# EAGLE schematic jncc3000 (EAGLE 6.5.0)
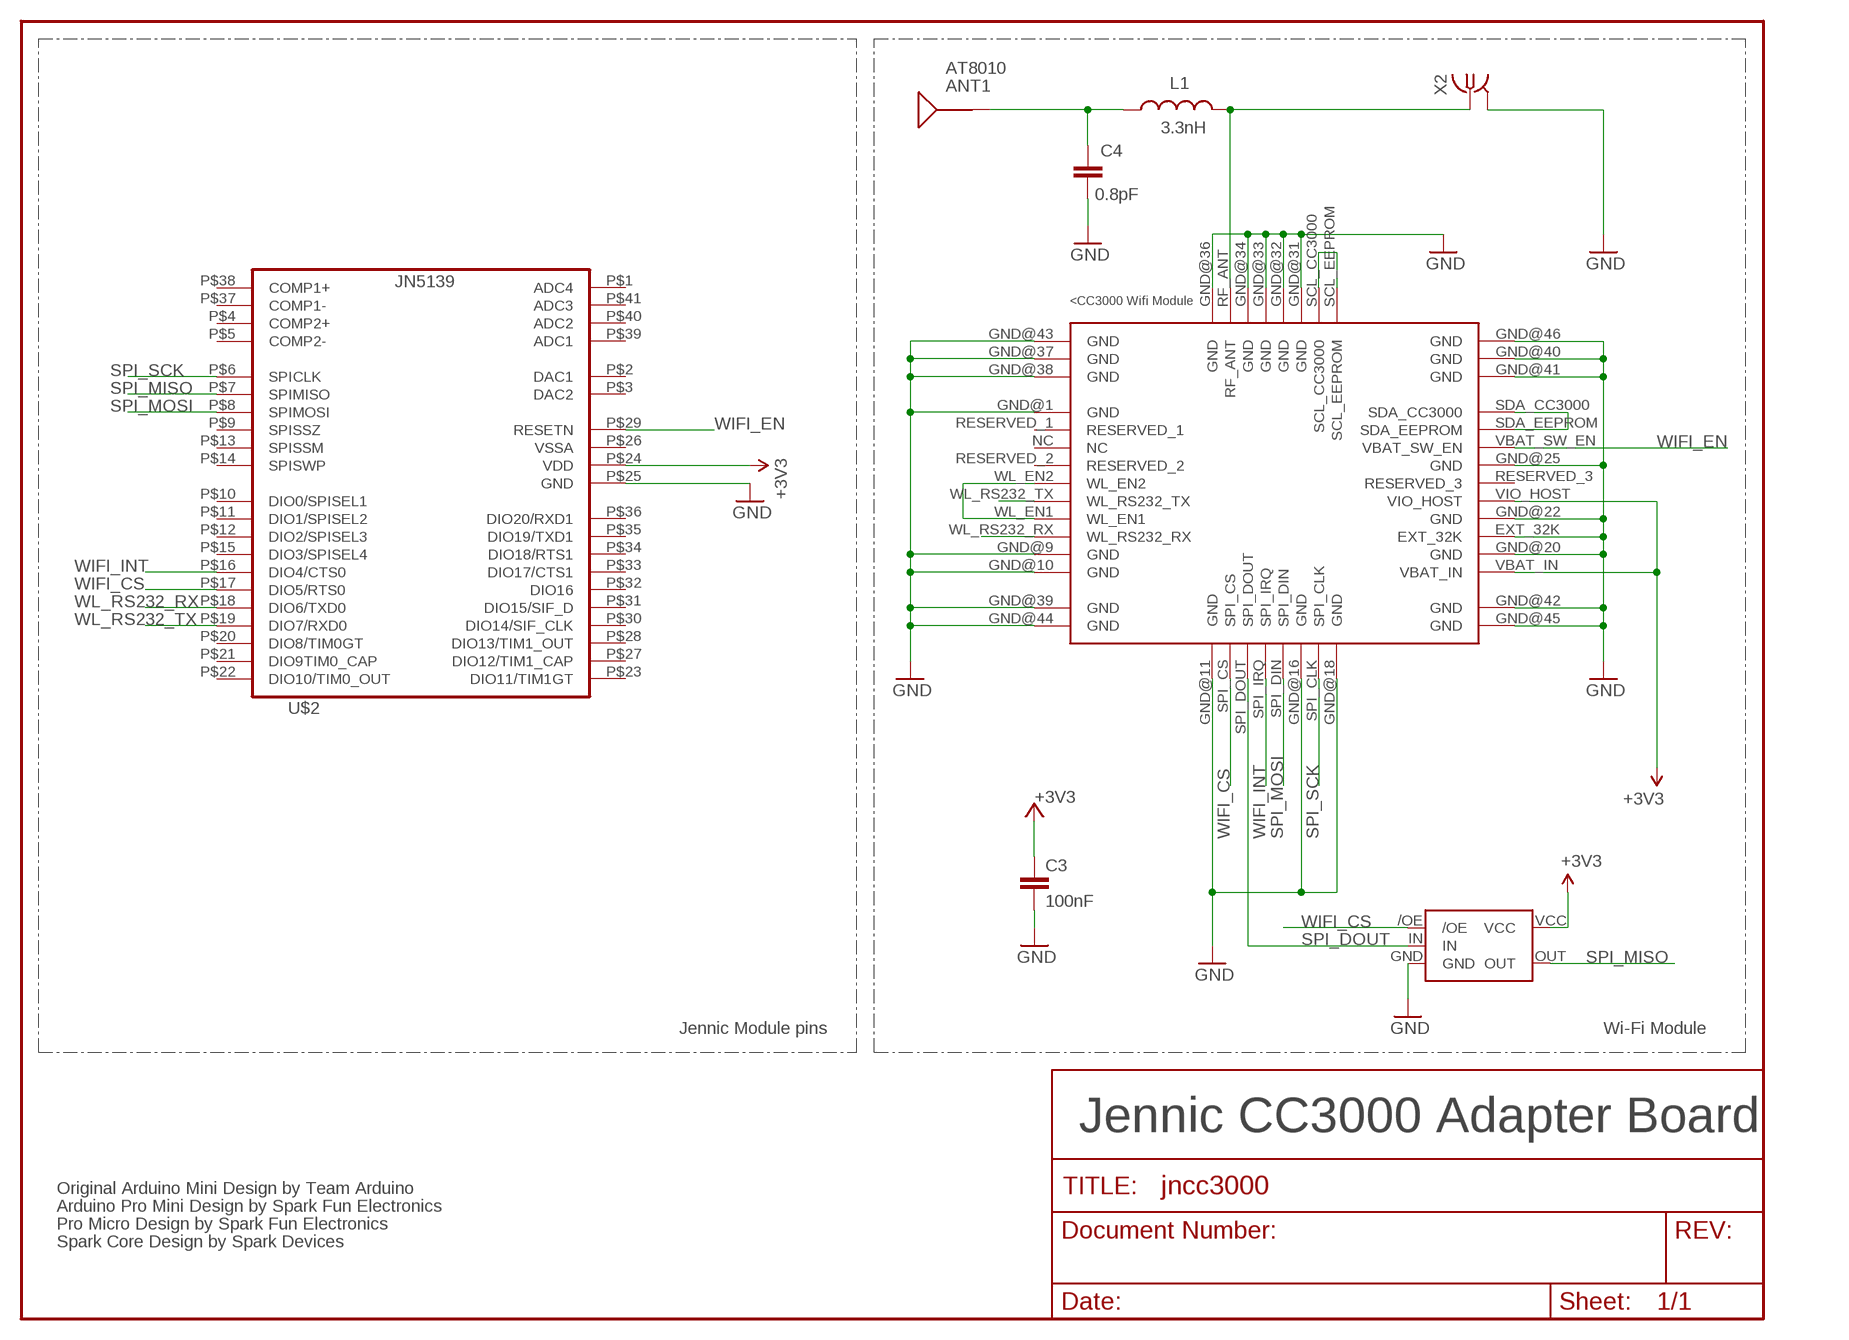
[diagram p0: schematic, sheet 1]

## Parts
ANT1  AT8010  [AT8010]
C3  100nF  C-EUC0603  [C0603]
C4  0.8pF  C-EUC0603  [C0603]
L1  3.3nH  INDUCTOR0603  [0603]
U1  CC3000  [CC3000]
U4  NL17SZ125SOT553  [SOT-553]
U$2  JENNIC_JN51XXTH  [JN5139_TH]
X2  IPEX-20279-001E  [IPEX-20279-001E]

## Nets
+3V3: C3.1 U1.VBAT_IN U1.VIO_HOST U4.VCC U$2.P$24(VDD)
GND [vcc]: C3.2 C4.2 U1.EXT_32K U1.GND@1(GND) U1.GND@9(GND) U1.GND@10(GND) U1.GND@11(GND) U1.GND@16(GND) U1.GND@18(GND) U1.GND@20(GND) U1.GND@22(GND) U1.GND@25(GND) U1.GND@31(GND) U1.GND@32(GND) U1.GND@33(GND) U1.GND@34(GND) U1.GND@36(GND) U1.GND@37(GND) U1.GND@38(GND) U1.GND@39(GND) U1.GND@40(GND) U1.GND@41(GND) U1.GND@42(GND) U1.GND@43(GND) U1.GND@44(GND) U1.GND@45(GND) U1.GND@46(GND) U4.GND U$2.P$25(GND) X2.2@1(GND) X2.2@2(GND)
N$2 [RF]: L1.2 U1.RF_ANT X2.1
N$3 [RF]: ANT1.SIG(SIGNAL) C4.1 L1.1
N$7: U1.SCL_CC3000 U1.SCL_EEPROM
N$9: U1.WL_EN1 U1.WL_EN2
N$15: U1.SDA_CC3000 U1.SDA_EEPROM
SPI_DOUT: U1.SPI_DOUT U4.IN
SPI_MISO: U4.OUT U$2.P$7(SPIMISO)
SPI_MOSI: U1.SPI_DIN U$2.P$8(SPIMOSI)
SPI_SCK: U1.SPI_CLK U$2.P$6(SPICLK)
WIFI_CS: U1.SPI_CS U4./OE U$2.P$17(DIO5/RTS0)
WIFI_EN: U1.VBAT_SW_EN U$2.P$29(RESETN)
WIFI_INT: U1.SPI_IRQ U$2.P$16(DIO4/CTS0)
WL_RS232_RX: U1.WL_RS232_RX U$2.P$18(DIO6/TXD0)
WL_RS232_TX: U1.WL_RS232_TX U$2.P$19(DIO7/RXD0)
Unconnected: U1.NC U1.RESERVED_1 U1.RESERVED_2 U1.RESERVED_3 U$2.P$1(ADC4) U$2.P$2(DAC1) U$2.P$3(DAC2) U$2.P$4(COMP2+) U$2.P$5(COMP2-) U$2.P$9(SPISSZ) U$2.P$10(DIO0/SPISEL1) U$2.P$11(DIO1/SPISEL2) U$2.P$12(DIO2/SPISEL3) U$2.P$13(SPISSM) U$2.P$14(SPISWP) U$2.P$15(DIO3/SPISEL4) U$2.P$20(DIO8/TIM0GT) U$2.P$21(DIO9TIM0_CAP) U$2.P$22(DIO10/TIM0_OUT) U$2.P$23(DIO11/TIM1GT) U$2.P$26(VSSA) U$2.P$27(DIO12/TIM1_CAP) U$2.P$28(DIO13/TIM1_OUT) U$2.P$30(DIO14/SIF_CLK) U$2.P$31(DIO15/SIF_D) U$2.P$32(DIO16) U$2.P$33(DIO17/CTS1) U$2.P$34(DIO18/RTS1) U$2.P$35(DIO19/TXD1) U$2.P$36(DIO20/RXD1) U$2.P$37(COMP1-) U$2.P$38(COMP1+) U$2.P$39(ADC1) U$2.P$40(ADC2) U$2.P$41(ADC3)

## Notes on the sheet
- Jennic Module pins | Wi-Fi Module
- Jennic CC3000 Adapter Board
- Original Arduino Mini Design by Team Arduino
- Arduino Pro Mini Design by Spark Fun Electronics
- Pro Micro Design by Spark Fun Electronics
- Spark Core Design by Spark Devices

## Library data of the parts
ANT1 = Spark:AT8010: AT8010 Series Multilayer Chip Antenna; DIGIKEY: www.digikey.de/product-detail/en/2500AT44M0400E/712-1403-1-ND/1840081
C3 = rcl:C-EU: CAPACITOR, European symbol; DIGIKEY: www.digikey.de/product-detail/en/CC0603KRX7R8BB104/311-1341-1-ND/2103125
C4 = rcl:C-EU: CAPACITOR, European symbol; COMMENT: RF Capacitor; DIGIKEY: www.digikey.de/product-detail/en/251R14S0R8BV4T/712-1305-1-ND/1786767
L1 = SparkFun-Passives:INDUCTOR: Inductors Basic Inductor/Choke - 0603 and 1206. Footprints are not proven and vary greatly between part numbers.; COMMENT: RF Inductor; DIGIKEY: www.digikey.de/product-detail/en/L-14C3N3SV4T/712-1428-1-ND/1914878
U1 = jncc3000.lbrjncc3000:CC3000; DIGIKEY: www.digikey.de/product-detail/en/CC3000MODR/296-35512-1-ND/3768439
U4 = jncc3000.lbrjncc3000:NL17SZ125; DIGIKEY: www.digikey.de/product-detail/en/NL17SZ125XV5T2G/NL17SZ125XV5T2GOSCT-ND/3462428
U$2 = jncc3000.lbrjncc3000:JENNIC_JN51XX: JN5139-xxx-M00xxx, Farnell: 1500175; PLACE: no
X2 = Spark:IPEX-20279-001E: Ultra Miniature Coaxial SMT RF Receptacle; PLACE: no

## Net classes
2 RF: width 0.635 mm, clearance 0.762 mm